# EAGLE design microdrone (EAGLE 9.2.2)
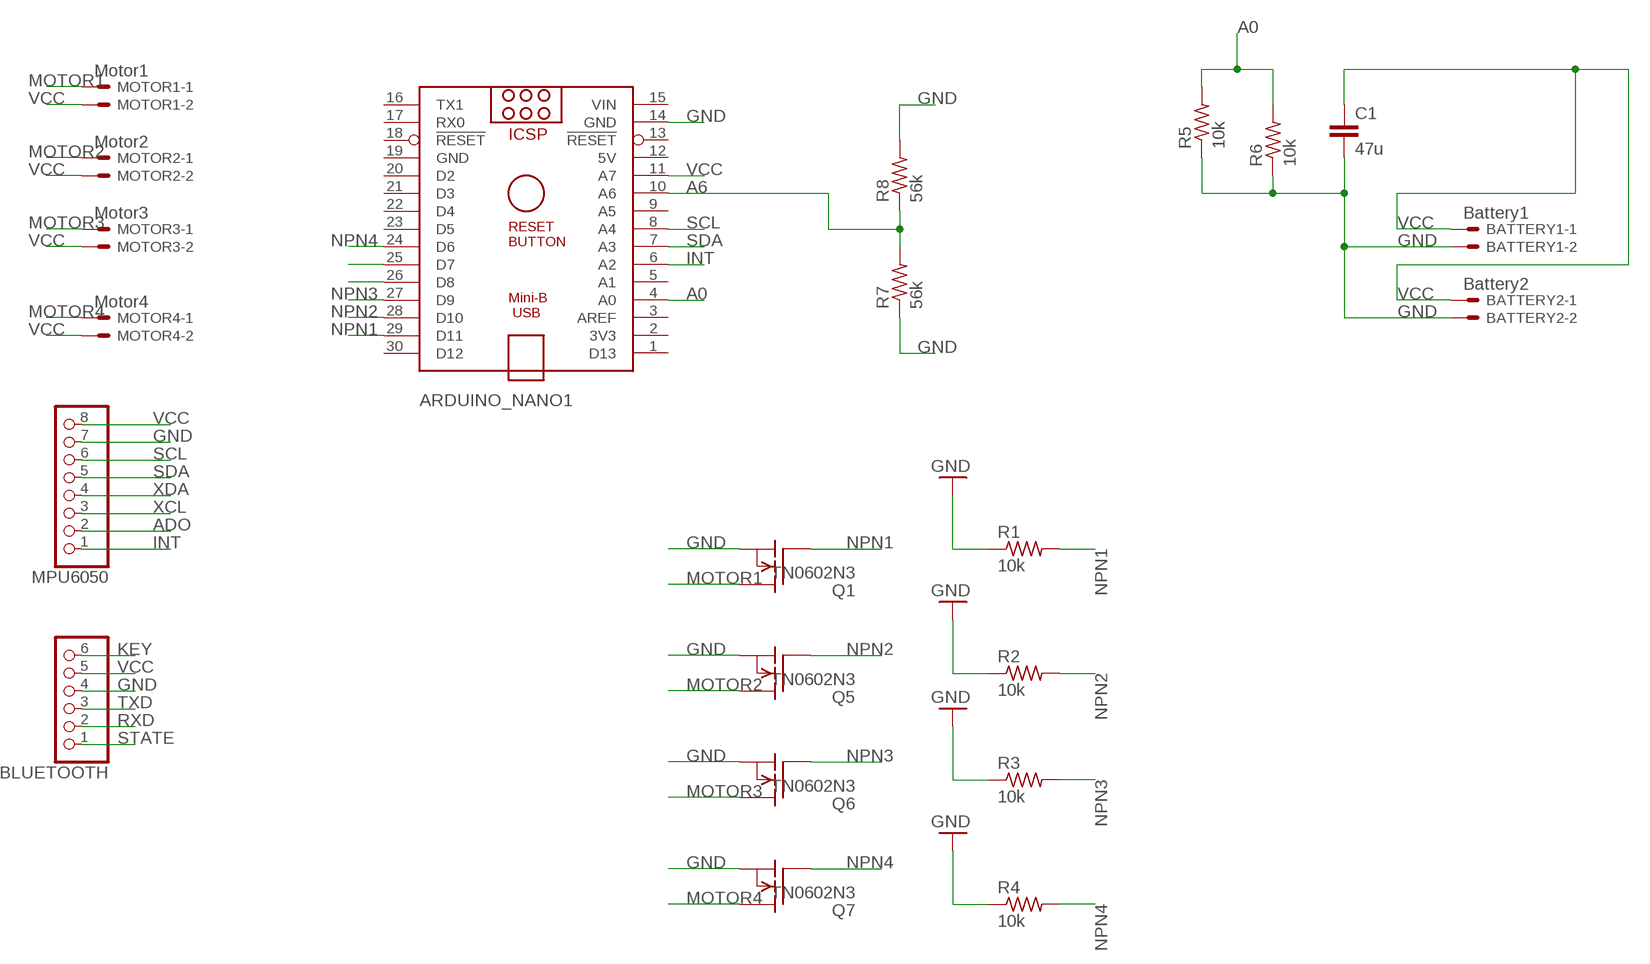
[diagram p0: schematic, sheet 1]

## Parts
ARDUINO_NANO1  ARDUINO_NANO  [ARDUINO_NANO]
BATTERY1  Battery1  JST-XH-02-PIN-LONG-PAD  [JST-XH-02-PACKAGE-LONG-PAD]
BATTERY2  Battery2  JST-XH-02-PIN-LONG-PAD  [JST-XH-02-PACKAGE-LONG-PAD]
BLUETOOTH  PINHD-1X6  [1X06]
C1  47u  C2,5-3  [C2.5-3]
MOTOR1  Motor1  JST-XH-02-PIN-LONG-PAD  [JST-XH-02-PACKAGE-LONG-PAD]
MOTOR2  Motor2  JST-XH-02-PIN-LONG-PAD  [JST-XH-02-PACKAGE-LONG-PAD]
MOTOR3  Motor3  JST-XH-02-PIN-LONG-PAD  [JST-XH-02-PACKAGE-LONG-PAD]
MOTOR4  Motor4  JST-XH-02-PIN-LONG-PAD  [JST-XH-02-PACKAGE-LONG-PAD]
MPU6050  PINHD-1X8  [1X08]
Q1  TN0602N3  [TO-92]
Q5  TN0602N3  [TO-92]
Q6  TN0602N3  [TO-92]
Q7  TN0602N3  [TO-92]
R1  10k  R-US_0204/7  [0204/7]
R2  10k  R-US_0204/7  [0204/7]
R3  10k  R-US_0204/7  [0204/7]
R4  10k  R-US_0204/7  [0204/7]
R5  10k  R-US_0204/7  [0204/7]
R6  10k  R-US_0204/7  [0204/7]
R7  56k  R-US_0204/7  [0204/7]
R8  56k  R-US_0204/7  [0204/7]

## Nets
A0: ARDUINO_NANO1.4(A0) R5.2 R6.2
A6: ARDUINO_NANO1.10(A6) R7.2 R8.1
ADO: MPU6050.2
GND: ARDUINO_NANO1.14(GND) BATTERY1.2 BATTERY2.2 BLUETOOTH.4 C1.2 MPU6050.7 Q1.1(S) Q5.1(S) Q6.1(S) Q7.1(S) R1.1 R2.1 R3.1 R4.1 R5.1 R6.1 R7.1 R8.2
INT: ARDUINO_NANO1.6(A2) MPU6050.1
KEY: BLUETOOTH.6
MOTOR1: MOTOR1.1 Q1.3(D)
MOTOR2: MOTOR2.1 Q5.3(D)
MOTOR3: MOTOR3.1 Q6.3(D)
MOTOR4: MOTOR4.1 Q7.3(D)
N$19: ARDUINO_NANO1.26(D8)
N$20: ARDUINO_NANO1.25(D7)
NPN1: ARDUINO_NANO1.29(D11) Q1.2(G) R1.2
NPN2: ARDUINO_NANO1.28(D10) Q5.2(G) R2.2
NPN3: ARDUINO_NANO1.27(D9) Q6.2(G) R3.2
NPN4: ARDUINO_NANO1.24(D6) Q7.2(G) R4.2
RXD: BLUETOOTH.2
SCL: ARDUINO_NANO1.8(A4) MPU6050.6
SDA: ARDUINO_NANO1.7(A3) MPU6050.5
STATE: BLUETOOTH.1
TXD: BLUETOOTH.3
VCC: ARDUINO_NANO1.11(A7) BATTERY1.1 BATTERY2.1 BLUETOOTH.5 C1.1 MOTOR1.2 MOTOR2.2 MOTOR3.2 MOTOR4.2 MPU6050.8
XCL: MPU6050.3
XDA: MPU6050.4
Unconnected: ARDUINO_NANO1.1(D13) ARDUINO_NANO1.2(3V3) ARDUINO_NANO1.3(AREF) ARDUINO_NANO1.5(A1) ARDUINO_NANO1.9(A5) ARDUINO_NANO1.13(!RESET) ARDUINO_NANO1.16(TX1) ARDUINO_NANO1.17(RX0) ARDUINO_NANO1.18(!RESET) ARDUINO_NANO1.20(D2) ARDUINO_NANO1.21(D3) ARDUINO_NANO1.22(D4) ARDUINO_NANO1.23(D5) ARDUINO_NANO1.30(D12)

## Power pins joined to a net without a drawn wire
5V: ARDUINO_NANO1.12(5V)
GND: ARDUINO_NANO1.19(GND)
VIN: ARDUINO_NANO1.15(VIN)

## Library data of the parts
ARDUINO_NANO1 = ArduinoNanoV30:ARDUINO_NANO: Arduino Nano V3.0 Overview: The Arduino Nano is a small, complete, and breadboard-friendly board based on the ATmega328 (Arduino Nano 3.x) or ATmega168 (Arduino Nano 2.x). It has more or less the same functionality of the Arduino Duemilanove, but in a different package. It lacks only a DC power jack, and works with a Mini-B USB cable instead of a standard one. The Nano was designed and is being produced by Gravitech. Specifications: Microcontroller Atmel ATmega168 or ATmega328 Operating Voltage (logic level) 5 V Input Voltage (recommended) 7-12 V Input Voltage (limits) 6-20 V Digital I/O Pins 14 (of which 6 provide PWM output) Analog Input Pins 8 DC Current per I/O Pin 40 mA Flash Memory 16 KB (ATmega168) or 32 KB (ATmega328) of which 2 KB used by bootloader SRAM 1 KB (ATmega168) or 2 KB (ATmega328) EEPROM 512 bytes (ATmega168) or 1 KB (ATmega328) Clock Speed 16 MHz Dimensions 0.73" x 1.70" Length 45 mm Width 18 mm Weigth 5 g Power: The Arduino Nano can be powered via the Mini-B USB connection, 6-20V unregulated external power supply (pin 30), or 5V regulated external power supply (pin 27). The power source is automatically selected to the highest voltage source. Memory: The ATmega168 has 16 KB of flash memory for storing code (of which 2 KB is used for the bootloader); the ATmega328 has 32 KB, (also with 2 KB used for the bootloader). The ATmega168 has 1 KB of SRAM and 512 bytes of EEPROM (which can be read and written with the EEPROM library); the ATmega328 has 2 KB of SRAM and 1 KB of EEPROM. Input and Output: Each of the 14 digital pins on the Nano can be used as an input or output, using pinMode(), digitalWrite(), and digitalRead() functions. They operate at 5 volts. Each pin can provide or receive a maximum of 40 mA and has an internal pull-up resistor (disconnected by default) of 20-50 kOhms. In addition, some pins have specialized functions. Visit Arduino - ArduinoBoardNano <https://www.arduino.cc/en/Main/ArduinoBoardNano>
BATTERY1 BATTERY2 MOTOR1-MOTOR4 = Rembrandt Electronics - JST XH Connectors v1-0:JST-XH-02-PIN: JST XH Connector 2 Pin Wire to board connector. Pitch: 2,54 mm, (0.100") Number of pins: 2 Created by Rembrandt Electronics www.rembrandtelectronics.com
BLUETOOTH = pinhead:PINHD-1X6: PIN HEADER
C1 = capacitor-wima:C: CAPACITOR naming: grid - package width
MPU6050 = pinhead:PINHD-1X8: PIN HEADER
Q1 Q5-Q7 = transistor-fet:TN0602N3: N-Channel Enhancement MOSFET 20V; 4A; 0,75Ohm
R1-R8 = resistor:R-US_: RESISTOR, American symbol

## Board
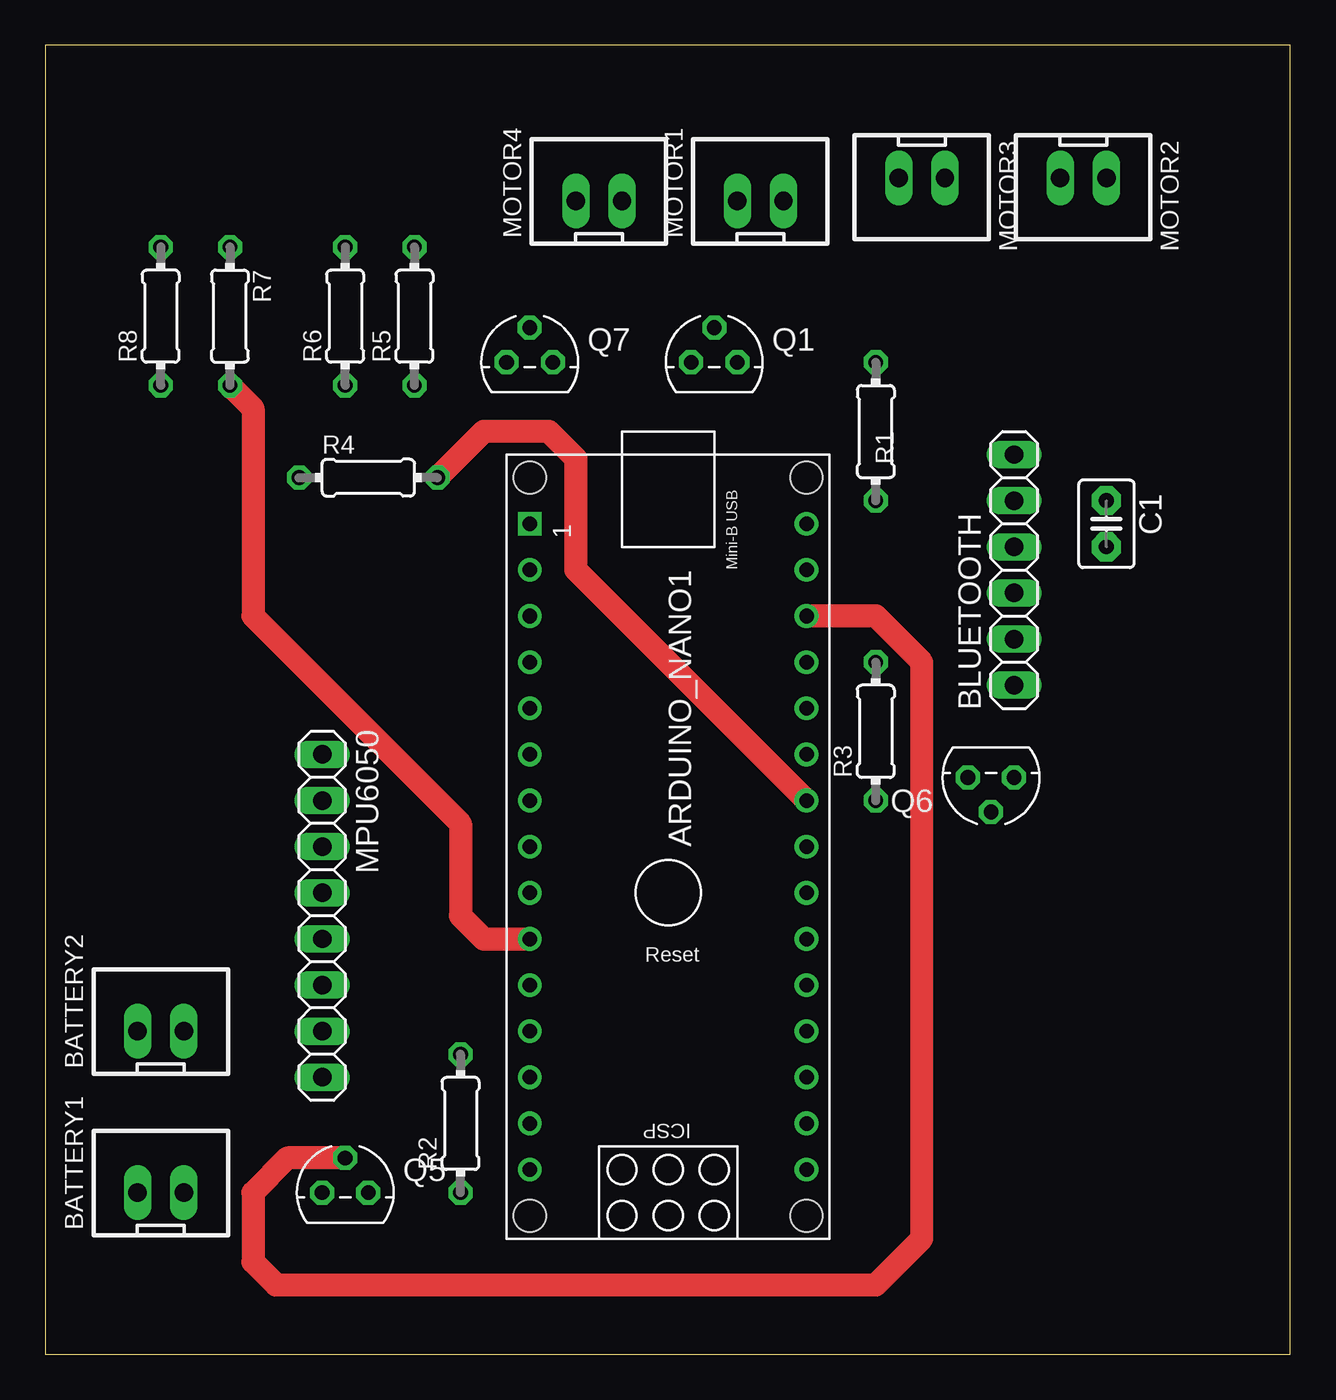
[diagram p1: board, top side]
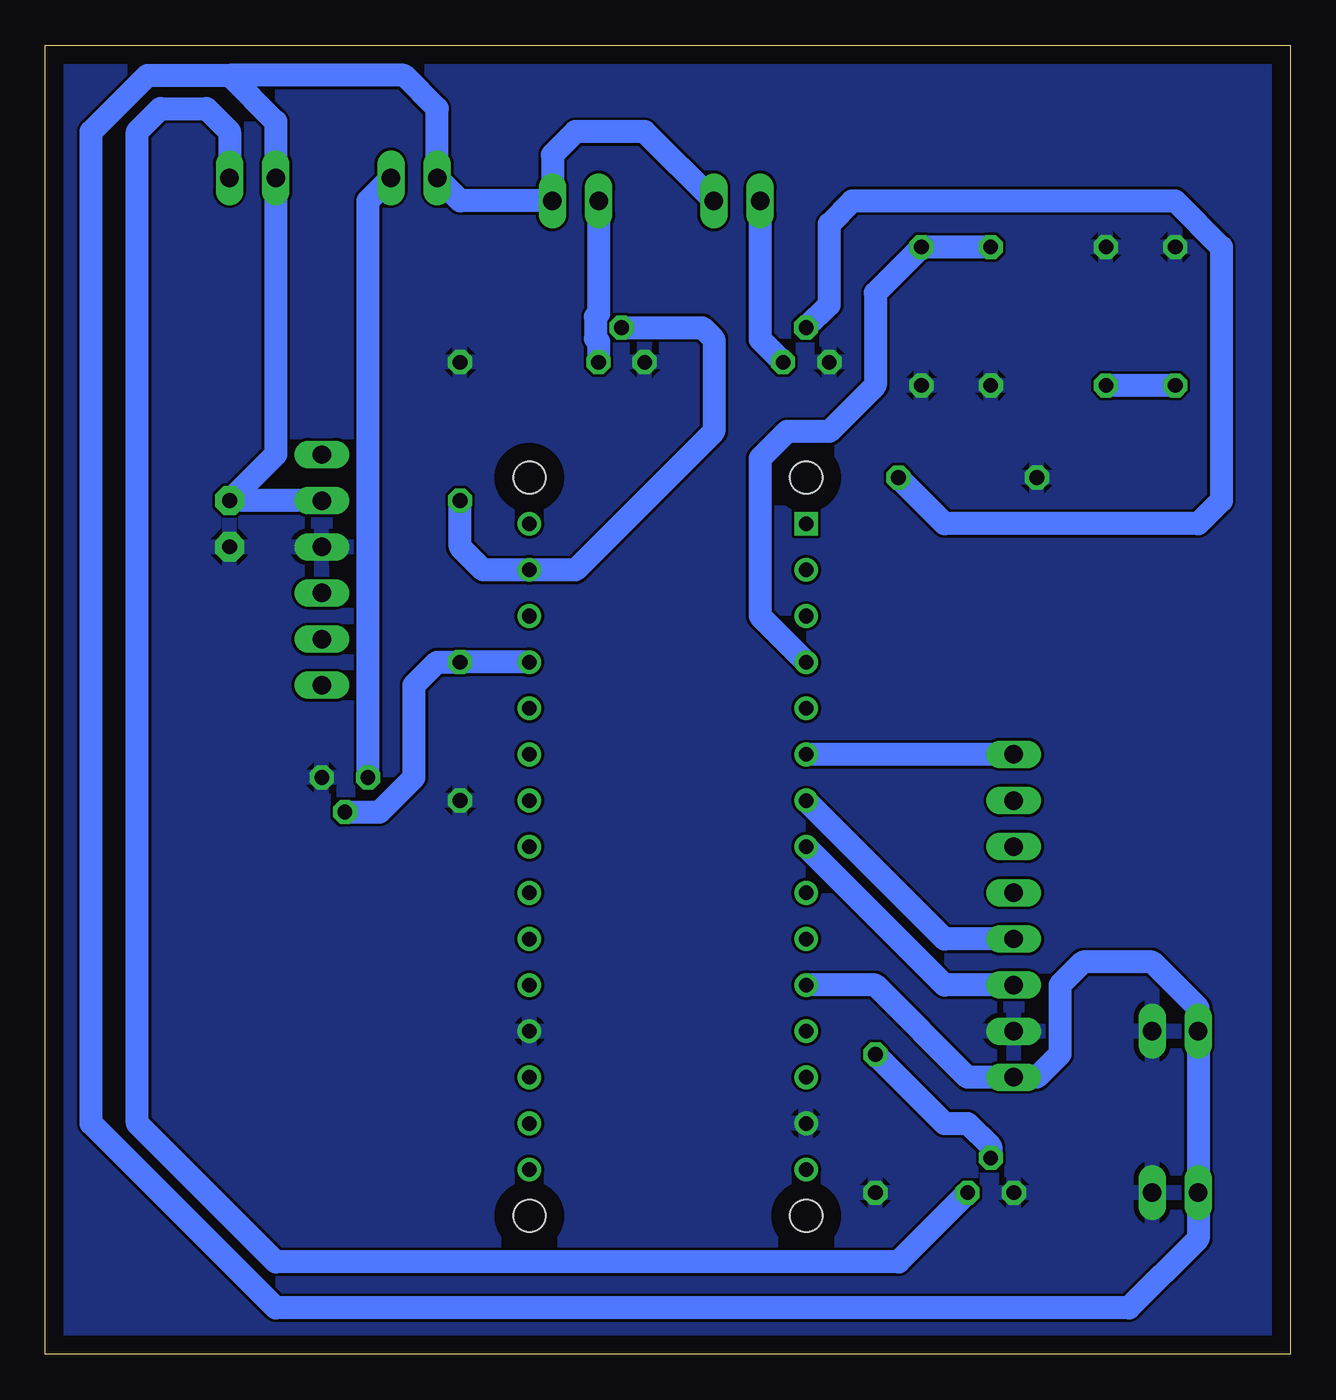
[diagram p2: board, bottom side, seen from below]

Size 68.56 x 72.06 mm. Coordinates in mm from the lower left corner, seen from the top.
Outline: 0,0 68.56,0 68.56,72.06 0,72.06 0,0
Copper layers (1*16): Top 0.035mm / dielectric 1.5mm / Bottom 0.035mm
Design rules "default": minimum track width 6mil, minimum drill 0.35mm, track to track 6mil, track to pad 6mil, pad to pad 6mil, via to via 6mil, smd to smd 6mil, copper to edge 40mil, drill to drill 6mil, minimum pad ring 10mil, minimum via ring 8mil, stop-mask expansion 4mil, vias tented up to drill 0mil, thermal gap 10mil

### Footprints (pad centres in the part's own frame; a part is rotated, then mirrored left to right if it is on the bottom)
ARDUINO_NANO = drill 0.8 square: 1 -20.32,-7.62 | drill 0.8: 2 -17.78,-7.62; 3 -15.24,-7.62; 4 -12.7,-7.62; 5 -10.16,-7.62; 6 -7.62,-7.62; 7 -5.08,-7.62; 8 -2.54,-7.62; 9 0,-7.62; 10 2.54,-7.62; 11 5.08,-7.62; 12 7.62,-7.62; 13 10.16,-7.62; 14 12.7,-7.62; 15 15.24,-7.62; 16 15.24,7.62; 17 12.7,7.62; 18 10.16,7.62; 19 7.62,7.62; 20 5.08,7.62; 21 2.54,7.62; 22 0,7.62; 23 -2.54,7.62; 24 -5.08,7.62; 25 -7.62,7.62; 26 -10.16,7.62; 27 -12.7,7.62; 28 -15.24,7.62; 29 -17.78,7.62; 30 -20.32,7.62 | hole 1.778: -22.86,-7.62; -22.86,7.62; 17.78,7.62; 17.78,-7.62
JST-XH-02-PACKAGE-LONG-PAD = drill 1.016 long: 1 -1.27,0; 2 1.27,0
1X06 = drill 1.016 long: 1 -6.35,0; 2 -3.81,0; 3 -1.27,0; 4 1.27,0; 5 3.81,0; 6 6.35,0
C2.5-3 = drill 0.813 pad 1.6 octagon: 1 -1.27,0; 2 1.27,0
1X08 = drill 1.016 long: 1 -8.89,0; 2 -6.35,0; 3 -3.81,0; 4 -1.27,0; 5 1.27,0; 6 3.81,0; 7 6.35,0; 8 8.89,0
TO-92 = drill 0.813 octagon: 1 -1.27,0; 2 0,1.905; 3 1.27,0
0204/7 = drill 0.813 octagon: 1 -3.81,0; 2 3.81,0

### Placement (x,y rotation side)
ARDUINO_NANO1  34.29,25.4 270 top
BATTERY1  6.35,8.89 0 top
BATTERY2  6.35,17.78 0 top
BLUETOOTH  53.34,43.18 90 top
C1  58.42,45.72 270 top
MOTOR1  39.37,63.5 0 top
MOTOR2  57.15,64.77 180 top
MOTOR3  48.26,64.77 180 top
MOTOR4  30.48,63.5 0 top
MPU6050  15.24,24.13 270 top
Q1  36.83,54.61 0 top
Q5  16.51,8.89 0 top
Q6  52.07,31.75 180 top
Q7  26.67,54.61 0 top
R1  45.72,50.8 270 top
R2  22.86,12.7 90 top
R3  45.72,34.29 90 top
R4  17.78,48.26 0 top
R5  20.32,57.15 90 top
R6  16.51,57.15 90 top
R7  10.16,57.15 270 top
R8  6.35,57.15 90 top

### Tracks (layer width: path | path; a pad name or v marks a point on that pad's centre or on a via)
A0
  Bottom 1.27: R6.2 R5.2 22.86,58.42 22.86,53.34 25.4,50.8 27.72,50.8 29.21,49.31 29.21,40.64 ARDUINO_NANO1.4
A6
  Top 1.27: R7.2 11.43,52.07 11.43,40.64 22.86,29.21 22.86,24.13 24.13,22.86 ARDUINO_NANO1.10
  Bottom 1.27: R8.1 R7.2
GND
  pour Bottom: 0,72.39 68.58,72.39 68.58,0 0,0
INT
  Bottom 1.27: MPU6050.1 ARDUINO_NANO1.6
MOTOR1
  Bottom 1.27: MOTOR1.1 38.1,57.29 38.28,57.11 38.28,55.91 38.1,55.74 Q1.3
MOTOR2
  Bottom 1.27: Q5.3 21.59,5.08 55.88,5.08 63.5,12.7 63.5,67.31 62.23,68.58 59.69,68.58 58.42,67.31 MOTOR2.1
MOTOR3
  Bottom 1.27: Q6.3 50.8,63.5 MOTOR3.1
MOTOR4
  Bottom 1.27: MOTOR4.1 29.21,55.88 Q7.3
NPN1
  Bottom 1.27: Q1.2 32.38,56.52 31.75,55.88 31.75,50.8 39.37,43.18 ARDUINO_NANO1.29 44.45,43.18 45.72,44.45 R1.2
NPN2
  Top 1.27: Q5.2 13.34,10.8 11.43,8.89 11.43,5.08 12.7,3.81 45.72,3.81 48.26,6.35 48.26,38.1 45.72,40.64 ARDUINO_NANO1.28
  Bottom 1.27: R2.2 19.05,12.7 17.78,12.7 16.51,11.43 Q5.2
NPN3
  Bottom 1.27: ARDUINO_NANO1.27 R3.2 46.99,38.1 48.26,36.83 48.26,31.75 50.16,29.84 Q6.2
NPN4
  Top 1.27: ARDUINO_NANO1.24 29.21,43.18 29.21,49.31 27.72,50.8 24.13,50.8 R4.2
  Bottom 1.27: Q7.2 25.4,57.78 25.4,62.23 24.13,63.5 6.35,63.5 3.81,60.96 3.81,46.99 5.08,45.72 19.05,45.72 R4.2
SCL
  Bottom 1.27: MPU6050.6 19.05,20.32 ARDUINO_NANO1.8
SDA
  Bottom 1.27: MPU6050.5 19.05,22.86 ARDUINO_NANO1.7
VCC
  Bottom 1.27: MOTOR4.2 35.56,67.31 39.37,67.31 40.64,66.04 MOTOR1.2 45.72,63.5 MOTOR3.2 46.99,68.58 48.82,70.41 58.42,70.41 | ARDUINO_NANO1.11 22.86,20.32 17.78,15.24 MPU6050.8 13.97,15.24 12.7,16.51 12.7,20.32 11.43,21.59 7.62,21.59 5.08,19.05 BATTERY2.1 BATTERY1.1 5.08,6.35 8.89,2.54 55.88,2.54 66.04,12.7 66.04,67.31 62.94,70.41 58.42,70.41 | 58.42,70.41 55.88,67.87 MOTOR2.2 55.88,49.53 C1.1 BLUETOOTH.5